# EasyEDA Pro project ProPrj_MID360V2.0_2025-05-30.epro

# Schematic Schematic1
Board Name: Board1; Create Date: 2025-03-20; Page Name: P1; Project Name: New Project_2025-03-20_13-18-42; Schematic Name: Schematic1; Update Date: 2025-03-27; Company: 嘉立创EDA; Page Size: A4; Version: V1.0
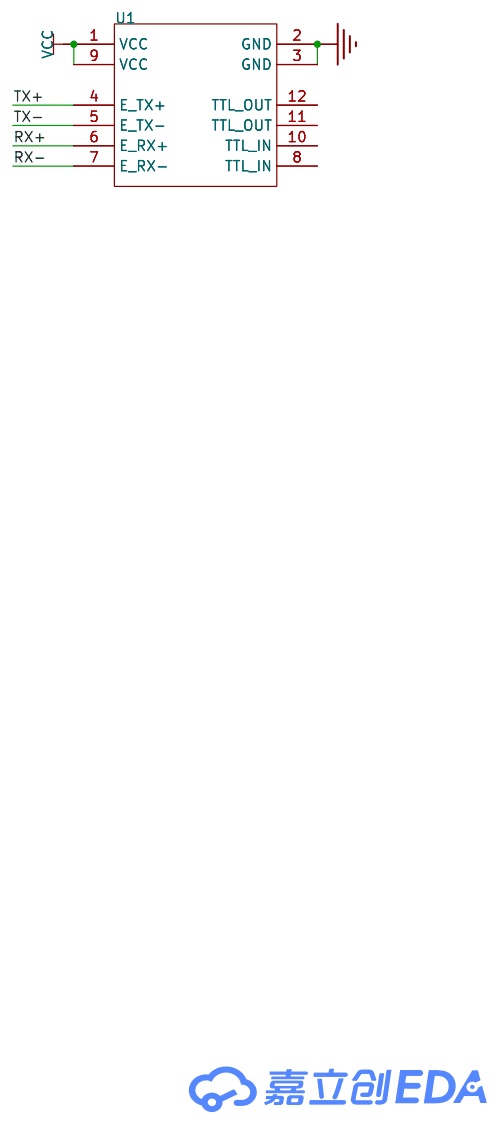
[diagram p0: schematic sheet]

## Parts
U1  -  [M12_A_12]

## Library data of the parts
U1 = mid360_m12

## Nets
GND: U1.2(GND) U1.3(GND)
VCC: U1.1(VCC) U1.9(VCC)
RX+: U1.6(E_RX+)
RX-: U1.7(E_RX-)
TX+: U1.4(E_TX+)
TX-: U1.5(E_TX-)

Not connected (* = marked no-connect by the designer): U1 8(TTL_IN) 10(TTL_IN) 11(TTL_OUT) 12(TTL_OUT)

# Board PCB1
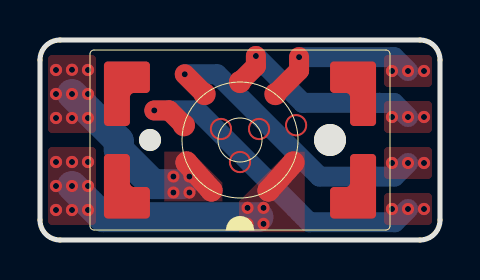
[diagram p1: board, top side]
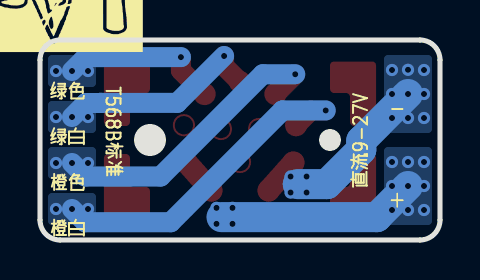
[diagram p2: board, bottom side, seen from below]

Outline 20 x 10 mm; copper layers: Top Layer, Bottom Layer. Coordinates in mm from the lower left corner of the outline.
Outline path: 0,9 arc(0.29,9.71) 1,10 19,10 arc(19.71,9.71) 20,9 20,1 arc(19.71,0.29) 19,0 1,0 arc(0.29,0.29) 0,1 0,9
Stack: Top Layer 0.035mm / Dielectric1 1.51mm FR4 er 4.5 / Bottom Layer 0.035mm

## Design rules (mm)
template: JLCPCB Capability(Two Layers Board)
spacing copperThickness1oz (default): track to track 0.102, other pairs 0.152 to 0.3
spacing copperThickness2oz: track to track 0.203, other pairs 0.152 to 0.3
track width copperThickness1oz (default): min 0.127, default 0.254, max 2.54
track width copperThickness2oz: min 0.203, default 0.254, max 2.54
differential pair differentialPair (default): width min 0.127, default 0.254, max 2.54; gap min 0.152, default 0.152
via viaSize (default): diameter min 0.5, default 0.61, max 10; hole min 0.3, default 0.305, max 6.3

## Placement (name value [footprint] x y rotation side)
U1  -  [M12_A_12]  10 5 180 top

## Footprints (pads in the part's own frame, mm; a bottom-side part is the same pattern mirrored in y, then rotated)
M12_A_12
  custom 1.01x1.01 smd: 1(-1.428,2.524) 2(1.428,2.524) 3(2.672,1.127) 4(2.804,-0.739) 5(1.77,-2.297) 6(0,-2.9) 7(-1.77,-2.297) 8(-2.804,-0.739) 9(-2.672,1.127) 10(0,1.1) 11(0.953,-0.55) 12(-0.953,-0.55)

## Nets
As in the schematic.

Pads without a net: U1 8 10 11 12

## Via types
v1: diameter 0.61, hole 0.305, Top Layer to Bottom Layer, 42 vias

## Routing (per net, layer and track width the routed paths; a pad name or vN(x,y) marks a point on that pad's centre or on a via; arc(x,y) is an arc through that point)
GND: length 9.5
  Top Layer w1.1: U1.3 U1.2
  Bottom Layer w1.5: 7.11,2.79 5.65,2.79 3.94,4.51 3.94,4.96 v1(1.6,7.3)
  vias: v1(0.8,8.5) v1(0.8,7.3) v1(0.8,6.1) v1(1.6,8.51) v1(1.6,6.1) v1(2.4,8.5) v1(2.4,7.3) v1(2.4,6.1) v1(6.67,3.17) v1(6.67,2.37) v1(7.47,3.17) v1(7.47,2.37)
VCC: length 11.8
  Top Layer w1.1: U1.1 U1.9
  Bottom Layer w1.5: v1(1.6,2.7) 3.16,1.14 10.92,1.14
  vias: v1(0.8,3.9) v1(0.8,2.7) v1(0.8,1.5) v1(1.6,3.9) v1(1.6,1.5) v1(2.4,3.9) v1(2.4,2.7) v1(2.4,1.5) v1(10.38,1.61) v1(10.38,0.81) v1(11.18,1.61) v1(11.18,0.81)
RX+: length 10.5
  Top Layer w1: v1(10.79,9.2) 10.79,8.69 U1.6
  Bottom Layer w1: v1(10.79,9.2) 13.14,6.86 16.98,6.86 16.99,6.85 17.7,6.85 v1(18.4,6.15)
  vias: v1(17.6,6.15) v1(19.2,6.15)
RX-: length 8.1
  Top Layer w1: v1(12.95,9.14) 12.95,8.48 U1.7
  Bottom Layer w1: v1(12.95,9.14) 17.71,9.14 v1(18.4,8.45)
  vias: v1(17.6,8.45) v1(19.2,8.45)
TX+: length 17.1
  Top Layer w1: v1(5.72,6.48) 6.46,6.48 U1.4
  Bottom Layer w1: v1(5.72,6.48) 7.87,6.48 13.46,0.89 17.74,0.89 v1(18.4,1.55)
  vias: v1(17.6,1.55) v1(19.2,1.55)
TX-: length 15
  Top Layer w1: U1.5 v1(7.24,8.29)
  Bottom Layer w1: v1(7.24,8.29) 8.86,8.29 13.97,3.17 17.72,3.17 v1(18.4,3.85)
  vias: v1(17.6,3.85) v1(19.2,3.85)

## Copper pours and planes (outline as drawn; the poured copper is in the pictures)
GND on Top Layer: 0.4,9.25 2.8,9.25 2.8,5.35 0.4,5.35
GND on Top Layer: 6.21,4.42 9.13,4.42 9.13,1.93 6.21,1.93
GND on Bottom Layer: 0.4,9.25 2.8,9.25 2.8,5.35 0.4,5.35
VCC on Top Layer: 9.95,4.42 13.23,4.42 13.23,0.39 9.95,0.39
VCC on Top Layer: 0.4,4.65 2.8,4.65 2.8,0.75 0.4,0.75
VCC on Bottom Layer: 0.4,4.65 2.8,4.65 2.8,0.75 0.4,0.75
RX+ on Top Layer: 17.2,6.95 19.6,6.95 19.6,5.35 17.2,5.35
RX+ on Bottom Layer: 17.2,6.95 19.6,6.95 19.6,5.35 17.2,5.35
RX- on Top Layer: 17.2,9.25 19.6,9.25 19.6,7.65 17.2,7.65
RX- on Bottom Layer: 17.2,9.25 19.6,9.25 19.6,7.65 17.2,7.65
TX+ on Top Layer: 17.2,2.35 19.6,2.35 19.6,0.75 17.2,0.75
TX+ on Bottom Layer: 17.2,2.35 19.6,2.35 19.6,0.75 17.2,0.75
TX- on Top Layer: 17.2,4.65 19.6,4.65 19.6,3.05 17.2,3.05
TX- on Bottom Layer: 17.2,4.65 19.6,4.65 19.6,3.05 17.2,3.05

Small or netless copper shapes (teardrops, artwork), in the pictures only: 2 on Bottom Layer

## Text on the board
Bottom Silkscreen Layer: — | 绿色 | 绿白 | 橙色 | 橙白 | T568B标准 | 直流9-27V | +
